# EAGLE schematic Powersupply (EAGLE 9.5.1)
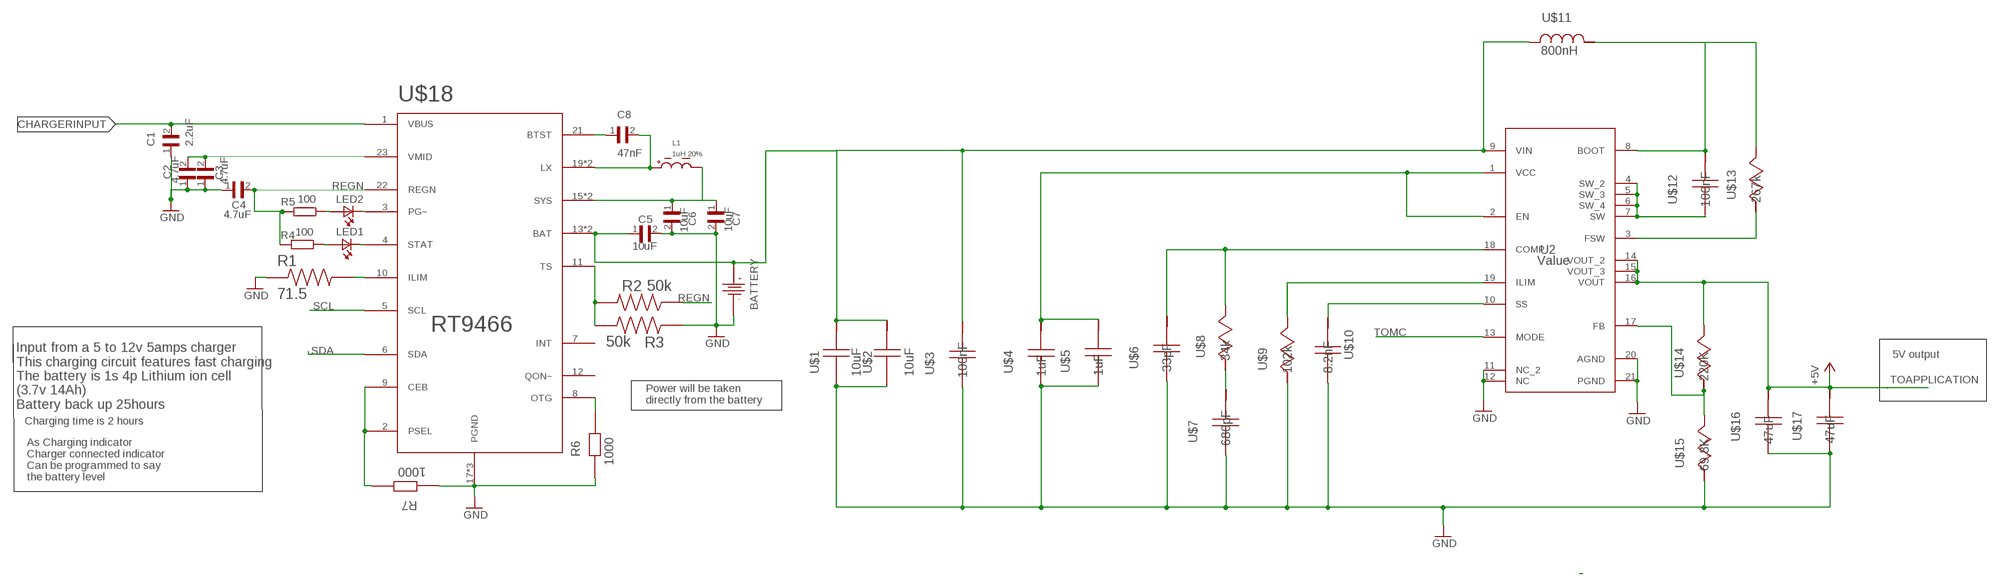
[diagram p0: schematic, sheet 1]

## Parts
BATT1  BATPADS  [PADSBATT]
C1  2.2uF  GRM155R61E225KE11D  [CAPC1005X70N]
C2  4.7uF  GRM188R61E475KE11D  [CAPC1608X95N]
C3  4.7uF  GRM188R61E475KE11D  [CAPC1608X95N]
C4  4.7uF  GRM188R61E475KE11D  [CAPC1608X95N]
C5  10uF  GRM185R60J106ME15J  [CAPC1608X50N]
C6  10uF  GRM185R60J106ME15J  [CAPC1608X50N]
C7  10uF  GRM185R60J106ME15J  [CAPC1608X50N]
C8  47nF  GRM033R61C473KE84D  [CAPC0603X33N]
L1  1uH 20%  74438356010  [4020]
LED1  LTST-C191KGKT  [0603]
LED2  LTST-C191KGKT  [0603]
R1  71.5  RC0402FR-0771R5L  [RESC1005X40N]
R2  50k  ERA-3AEB4992V  [RESC1608X55N]
R3  50k  ERA-3AEB4992V  [RESC1608X55N]
R4  RX0402_100  [RC0402_100]
R5  RX0402_100  [RC0402_100]
R6  1000  ERJ-2GEJ102X  [RESC1005X40N]
R7  1000  ERJ-2GEJ102X  [RESC1005X40N]
U2  Value  TPS61088RHLR  [RHL0020A]
U$1  10uF  CC1206ZKY5V7BB106  [1206_190]
U$2  10uF  CC1206ZKY5V7BB106  [1206_190]
U$3  100nF  CC0402KRX7R6BB104  [0402]
U$4  1uF  EMK107B7105KA-T  [0603]
U$5  1uF  EMK107B7105KA-T  [0603]
U$6  33pF  885012005043  [0402]
U$7  680pF  CL10C681JA8NNNC  [0603]
U$8  34k  CRCW040234K0FKED  [0402]
U$9  102k  CRCW0402102KFKED  [0402]
U$10  8.2nF  CC0402KRX7R7BB822  [0402]
U$11  800nH  XAL5020-801MEB  [XAL5020]
U$12  100nF  CC0402KRX5R7BB104  [0402]
U$13  267k  CRCW0402267KFKED  [0402]
U$14  220K  RC0603FR-07220KL  [0603]
U$15  69.8K  CRCW040269K8FKED  [0402]
U$16  47uF  C5750X5R1C476M230KA  [2220_250]
U$17  47uF  C5750X5R1C476M230KA  [2220_250]
U$18  RT9466  [V/W/U/XQFN4*4-24]

## Nets
+5V: U2.14(VOUT_2) U2.15(VOUT_3) U2.16(VOUT) U$14.1 U$16.1 U$17.1
BATT+: BATT1.1 C5.1 U2.9(VIN) U$1.1 U$2.1 U$3.1 U$11.1 U$18.13(BAT) U$18.14(BAT)
CHARGERINPUT: C1.2 U$18.1(VBUS)
GND: BATT1.2 C1.1 C2.1 C3.1 C4.1 C5.2 C6.2 C7.2 R1.1 R3.2 R6.1 R7.1 U2.11(NC_2) U2.12(NC) U2.20(AGND) U2.21(PGND) U$1.2 U$2.2 U$3.2 U$4.2 U$5.2 U$6.2 U$7.2 U$9.2 U$10.2 U$15.2 U$16.2 U$17.2 U$18.17(PGND) U$18.18(PGND) U$18.25(PGND)
N$2: C6.1 C7.1 L1.P$2 U$18.15(SYS) U$18.16(SYS)
N$5: U2.1(VCC) U2.2(EN) U$4.1 U$5.1
N$6: U$7.1 U$8.2
N$8: C2.2 C3.2 U$18.23(VMID)
N$9: U2.18(COMP) U$6.1 U$8.1
N$10: U2.19(ILIM) U$9.1
N$11: U2.10(SS) U$10.1
N$12: LED1.2(A2) R4.P$1
N$13: C8.1 U$18.21(BTST)
N$14: U2.3(FSW) U$13.2
N$15: U2.4(SW_2) U2.5(SW_3) U2.6(SW_4) U2.7(SW) U$12.2
N$16: U2.8(BOOT) U$11.2 U$12.1 U$13.1
N$17: C8.2 L1.P$1 U$18.19(LX) U$18.20(LX)
N$18: U2.17(FB) U$14.2 U$15.1
N$19: LED1.1(K2) U$18.4(STAT)
N$20: LED2.1(K2) U$18.3(PG~)
N$21: R1.2 U$18.10(ILIM)
N$22: R2.2 R3.1 U$18.11(TS)
N$23: LED2.2(A2) R5.P$1
N$24: R6.2 U$18.8(OTG)
N$25: R7.2 U$18.2(PSEL) U$18.9(CEB)
REGN: C4.2 R2.1 R4.P$2 R5.P$2 U$18.22(REGN)
SCL: U$18.5(SCL)
SDA: U$18.6(SDA)
TOMC: U2.13(MODE)
Unconnected: U$18.7(INT) U$18.12(QON~)

## Notes on the sheet
- BATTERY
- 5V output
- TOAPPLICATION
- Power will be taken
  directly from the battery
- Input from a 5 to 12v 5amps charger
  This charging circuit features fast charging
  The battery is 1s 4p Lithium ion cell
  (3.7v 14Ah)
  Battery back up 25hours
- Charging time is 2 hours
- As Charging indicator
  Charger connected indicator
  Can be programmed to say
  the battery level

## Library data of the parts
BATT1 = BatteryCharger:BATPADS: JUST 10 x 10 mm exposed pads for battery
C1 = BatteryCharger:GRM155R61E225KE11D; DESCRIPTION: SMD Capacitor X5R(EIA) with Capacitance: 2.2uF Tol. 10%. Rated Voltage: 25Vdc; DIGI-KEY_PART_NUMBER: 490-12703-1-ND; MF: Murata; MP: GRM155R61E225KE11D; PACKAGE: 1005 Murata
C2-C4 = BatteryCharger:GRM188R61E475KE11D: Cap Ceramic 4.7uF 25V X5R 10% Pad SMD 0603 85°C T/R; DESCRIPTION: SMD Capacitor X5R(EIA) with Capacitance: 4.7uF Tol. 10%. Rated Voltage: 25Vdc; DIGI-KEY_PART_NUMBER: 490-7203-1-ND; DIGIKEY-PURCHASE-URL: https://snapeda.com/shop?store=DigiKey&id=4377500; MF: Murata; MOUSER-PURCHASE-URL: https://snapeda.com/shop?store=Mouser&id=4377500; MP: GRM188R61E475KE11D; PACKAGE: 1608 Murata
C5-C7 = BatteryCharger:GRM185R60J106ME15J; DESCRIPTION: SMD Capacitor X5R(EIA) with Capacitance: 10uF Tol. 20%. Rated Voltage: 6.3Vdc; DIGI-KEY_PART_NUMBER: 490-16349-1-ND; DIGIKEY-PURCHASE-URL: https://snapeda.com/shop?store=DigiKey&id=4386484; MF: Murata; MOUSER-PURCHASE-URL: https://snapeda.com/shop?store=Mouser&id=4386484; MP: GRM185R60J106ME15J; PACKAGE: 1608 Murata
C8 = BatteryCharger:GRM033R61C473KE84D: Cap Ceramic 0.047uF 16V X5R 10% SMD 0201 85°C Paper T/R; DESCRIPTION: SMD Capacitor X5R(EIA) with Capacitance: 47000pF Tol. 10%. Rated Voltage: 16Vdc; DIGI-KEY_PART_NUMBER: 490-7227-1-ND; MF: Murata; MP: GRM033R61C473KE84D; PACKAGE: 0603 Taiyo Yuden
L1 = BatteryCharger:74438356010: 1µH Shielded Molded Inductor 7.2A 15mOhm Max 2-SMD Datasheet <https://www.digikey.in/product-detail/en/w%C3%BCrth-elektronik/74438356010/732-8228-1-ND/5725368>; MANUFACTURER: Würth Elektronik; PACKAGE: 4020; PARTNO: 74438356010
LED1 LED2 = BatteryCharger:LTST-C191KGKT: http://octopart.com/ltst-c190krkt-lite-on-549893; DESCRIPTION: Green 571nm LED Indication - Discrete 2V 0603 (1608 Metric); DIGI-KEY_PART_NUMBER: 160-1446-1-ND; MF: Lite-On Inc.; MP: LTST-C191KGKT; PACKAGE: 0603 Lite-On Inc.
R1 = BatteryCharger:RC0402FR-0771R5L: Res Thick Film 0402 71.5 Ohm 1% 1/16W ±100ppm/°C Molded SMD Paper T/R; ARROW_AMERICAS-PURCHASE-URL: https://snapeda.com/shop?store=Arrow+Americas&id=938739; DESCRIPTION: RC Series 0402 0.063 W 71.5 Ohms ±1% ±100 ppm/°C SMT Thick Film Chip Resistor; DIGI-KEY_PART_NUMBER: YAG3223CT-ND; MF: Yageo; MOUSER-PURCHASE-URL: https://snapeda.com/shop?store=Mouser&id=938739; MP: RC0402FR-0771R5L; PACKAGE: 1005 Panasonic Electronic Components
R2 R3 = BatteryCharger:ERA-3AEB4992V: Res Thin Film 0603 49.9K Ohm 0.1% 1/10W ±25ppm/°C Molded SMD SMD Punched Carrier T/R; DESCRIPTION: 49.9 kOhms ±0.1% 0.1W, 1/10W Chip Resistor 0603 (1608 Metric) Automotive AEC-Q200 Thin Film; DIGI-KEY_PART_NUMBER: P49.9KDBCT-ND; DIGIKEY-PURCHASE-URL: https://snapeda.com/shop?store=DigiKey&id=388585; MF: Panasonic; MOUSER-PURCHASE-URL: https://snapeda.com/shop?store=Mouser&id=388585; MP: ERA-3AEB4992V; PACKAGE: 1608 Panasonic Electronic Components
R4 R5 = Ampparts:RX0402_100
R6 R7 = Ampparts:ERJ-2GEJ102X; DESCRIPTION: 1 kOhms ±5% 0.1W, 1/10W Chip Resistor 0402 (1005 Metric) Automotive AEC-Q200 Thick Film; DIGI-KEY_PART_NUMBER: P1.0KJCT-ND; MF: Panasonic Electronic; MP: ERJ-2GEJ102X; PACKAGE: 1005 Panasonic Electronic Components
U2 = powersupply:TPS61088RHLR; ALTERNATEPARTNUMBER: TPS61088RHLT; APPLICATION_BUILDNUMBER: *; COMPTYPE: IC; MANUFACTURER: Texas Instruments; MANUFACTURER_NAME: Texas Instruments; MANUFACTURER_PART_NUMBER: TPS61088RHLR; MOUNTTYPE: SMT; PACKAGEREFERENCE: RHL0020A; PARTNUMBER: TPS61088RHLR; PIN_COUNT: 21; REFDES: RefDes; ROHS: Y; TYPE: TYPE
U$1 U$2 = powersupply:CC1206ZKY5V7BB106; CAP: 1.0E5; ESR: 0.0; IRMS: 0.0; MANUFACTURER_NAME: Yageo; MANUFACTURER_PART_NUMBER: CC1206ZKY5V7BB106; VDC: 16.0; VENDOR: Digikey
U$3 = powersupply:CC0402KRX7R6BB104; CAP: 1.0E7; ESR: 0.0; IRMS: 0.0; MANUFACTURER_NAME: Yageo; MANUFACTURER_PART_NUMBER: CC0402KRX7R6BB104; VDC: 10.0; VENDOR: MuRata
U$4 = powersupply:EMK107B7105KA-T; CAP: 1.0E6; DATASHEETURL: httpwww.yuden.co.jputproductpdfdjmk%5Fe.pdf; ESR: 0.001; IRMS: 0.0; MANUFACTURER_NAME: Taiyo Yuden; MANUFACTURER_PART_NUMBER: EMK107B7105KAT; SPICEPREFIX: B; VDC: 16.0; VENDOR: Taiyo Yuden
U$5 = powersupply:EMK107B7105KA-T; CAP: 1.0E6; DATASHEETURL: httpwww.yuden.co.jputproductpdfdjmk%5Fe.pdf; ESR: 0.001; IRMS: 0.0; MANUFACTURER_NAME: Taiyo Yuden; MANUFACTURER_PART_NUMBER: EMK107B7105KAT; VDC: 16.0; VENDOR: Taiyo Yuden
U$6 = powersupply:885012005043; CAP: 3.3E11; ESR: 0.0; IRMS: 0.0; MANUFACTURER_NAME: Würth Elektronik; MANUFACTURER_PART_NUMBER: 885012005043; VDC: 25.0; VENDOR: MuRata
U$7 = powersupply:CL10C681JA8NNNC; CAP: 6.8E10; DATASHEETURL: httpwww.samsungsem.comservletFileDownload?type%3Dspec%26file%3DCL10C681JA8NNNC.pdf; ESR: 0.0; IRMS: 0.0; MANUFACTURER_NAME: Samsung ElectroMechanics; MANUFACTURER_PART_NUMBER: CL10C681JA8NNNC; VDC: 25.0; VENDOR: Samsung ElectroMechanics
U$8 = powersupply:CRCW040234K0FKED; MANUFACTURER_NAME: VishayDale; MANUFACTURER_PART_NUMBER: CRCW040234K0FKED; POWER: 0.063; RESISTANCE: 34000.0; TOLERANCE: 1.0; VENDOR: VishayDale
U$9 = powersupply:CRCW0402102KFKED; MANUFACTURER_NAME: VishayDale; MANUFACTURER_PART_NUMBER: CRCW0402102KFKED; POWER: 0.063; RESISTANCE: 102000.0; TOLERANCE: 1.0; VENDOR: VishayDale
U$10 = powersupply:CC0402KRX7R7BB822; CAP: 8.2E9; ESR: 0.0; IRMS: 0.0; MANUFACTURER_NAME: Yageo; MANUFACTURER_PART_NUMBER: CC0402KRX7R7BB822; VDC: 16.0; VENDOR: MuRata
U$11 = powersupply:XAL5020-801MEB; DATASHEETURL: httpwww.coilcraft.compdfsxal5020.pdf; DCR: 0.0103; DESCRIPTION: Unknown; IDC: 12.0; L: 8.0E7; MANUFACTURER: CoilCraft; MANUFACTURER_NAME: Coilcraft; MANUFACTURER_PART_NUMBER: XAL5020801MEB; PACKAGE_DESIGNATOR: XAL5020; VENDOR: Coilcraft
U$12 = powersupply:CC0402KRX5R7BB104; CAP: 1.0E7; ESR: 0.0; IRMS: 0.0; MANUFACTURER_NAME: yageo; MANUFACTURER_PART_NUMBER: /CC0402KRX5R7BB104; VDC: 16.0; VENDOR: Digikey
U$13 = powersupply:CRCW0402267KFKED; MANUFACTURER_NAME: VishayDale; MANUFACTURER_PART_NUMBER: CRCW0402267KFKED; POWER: 0.063; RESISTANCE: 267000.0; TOLERANCE: 1.0; VENDOR: VishayDale
U$14 = powersupply:RC0603FR-07220KL; MANUFACTURER_NAME: Yageo; MANUFACTURER_PART_NUMBER: RC0603FR07220KL; POWER: 0.1; RESISTANCE: 220000.0; TOLERANCE: 1.0; VENDOR: Yageo America
U$15 = powersupply:CRCW040269K8FKED; MANUFACTURER_NAME: VishayDale; MANUFACTURER_PART_NUMBER: CRCW040269K8FKED; POWER: 0.063; RESISTANCE: 69800.0; TOLERANCE: 1.0; VENDOR: VishayDale
U$16 U$17 = powersupply:C5750X5R1C476M230KA; CAP: 4.7E5; DATASHEETURL: httpsproduct.tdk.comensearchcapacitorceramicmlccinfo?part%5Fno%3DC5750X5R1C476M230KA; ESR: 0.003162; IRMS: 5.13436; MANUFACTURER_NAME: TDK; MANUFACTURER_PART_NUMBER: C5750X5R1C476M230KA; VDC: 16.0; VENDOR: TDK
U$18 = BatteryCharger:RT9466: Charger IC Lithium Ion/Polymer 24-WQFN (4x4) datasheet <https://www.digikey.in/product-detail/en/richtek-usa-inc/RT9466GQW/RT9466GQWCT-ND/6676833>; MANUFACTURER: Richtek USA Inc.; PARTNAME: RT9466GQW